# EAGLE schematic Port Expander Using I2C (EAGLE 8.2.1)
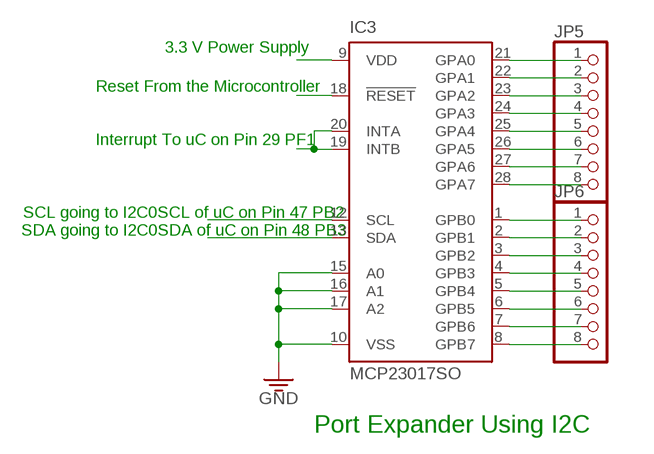
[diagram p0: schematic, sheet 1]

## Parts
IC3  MCP23017SO  [SO28W]
JP5  PINHD-1X8BIG  [1X08-BIG]
JP6  PINHD-1X8BIG  [1X08-BIG]

## Nets
3.3V [VDD]: IC3.9(VDD) IC3.10(VSS) IC3.15(A0) IC3.16(A1) IC3.17(A2) ; supply symbol labelled GND
INTAB: IC3.19(INTB) IC3.20(INTA)
N$2: IC3.21(GPA0) JP5.1
N$5: IC3.22(GPA1) JP5.2
N$8: IC3.23(GPA2) JP5.3
N$9: IC3.24(GPA3) JP5.4
N$10: IC3.25(GPA4) JP5.5
N$23: IC3.26(GPA5) JP5.6
N$32: IC3.27(GPA6) JP5.7
N$33: IC3.28(GPA7) JP5.8
N$34: IC3.1(GPB0) JP6.1
N$35: IC3.2(GPB1) JP6.2
N$36: IC3.3(GPB2) JP6.3
N$37: IC3.4(GPB3) JP6.4
N$38: IC3.5(GPB4) JP6.5
N$39: IC3.6(GPB5) JP6.6
N$40: IC3.7(GPB6) JP6.7
N$41: IC3.8(GPB7) JP6.8
RST: IC3.18(!RESET)
SCL: IC3.12(SCL)
SDA: IC3.13(SDA)

## Notes on the sheet
- 3.3 V Power Supply
- Reset From the Microcontroller
- Interrupt To uC on Pin 29 PF1
- SCL going to I2C0SCL of uC on Pin 47 PB2
- SDA going to I2C0SDA of uC on Pin 48 PB3
- Port Expander Using I2C

## Library data of the parts
IC3 = adafruit:MCP23017: http://ww1.microchip.com/downloads/en/DeviceDoc/21952a.pdf Source: http://ww1.microchip.com/downloads/en/DeviceDoc/21952a.pdf
JP5 JP6 = adafruit:PINHD-1X8: PIN HEADER

## Net classes
0 default: width 0.2 mm, clearance 0.2 mm
1 VSERVO: width 0.8 mm, clearance 0.2 mm
2 VDD: width 0.5 mm, clearance 0.2 mm